# EAGLE design lightswitchx2_triac (EAGLE 7.6.0)
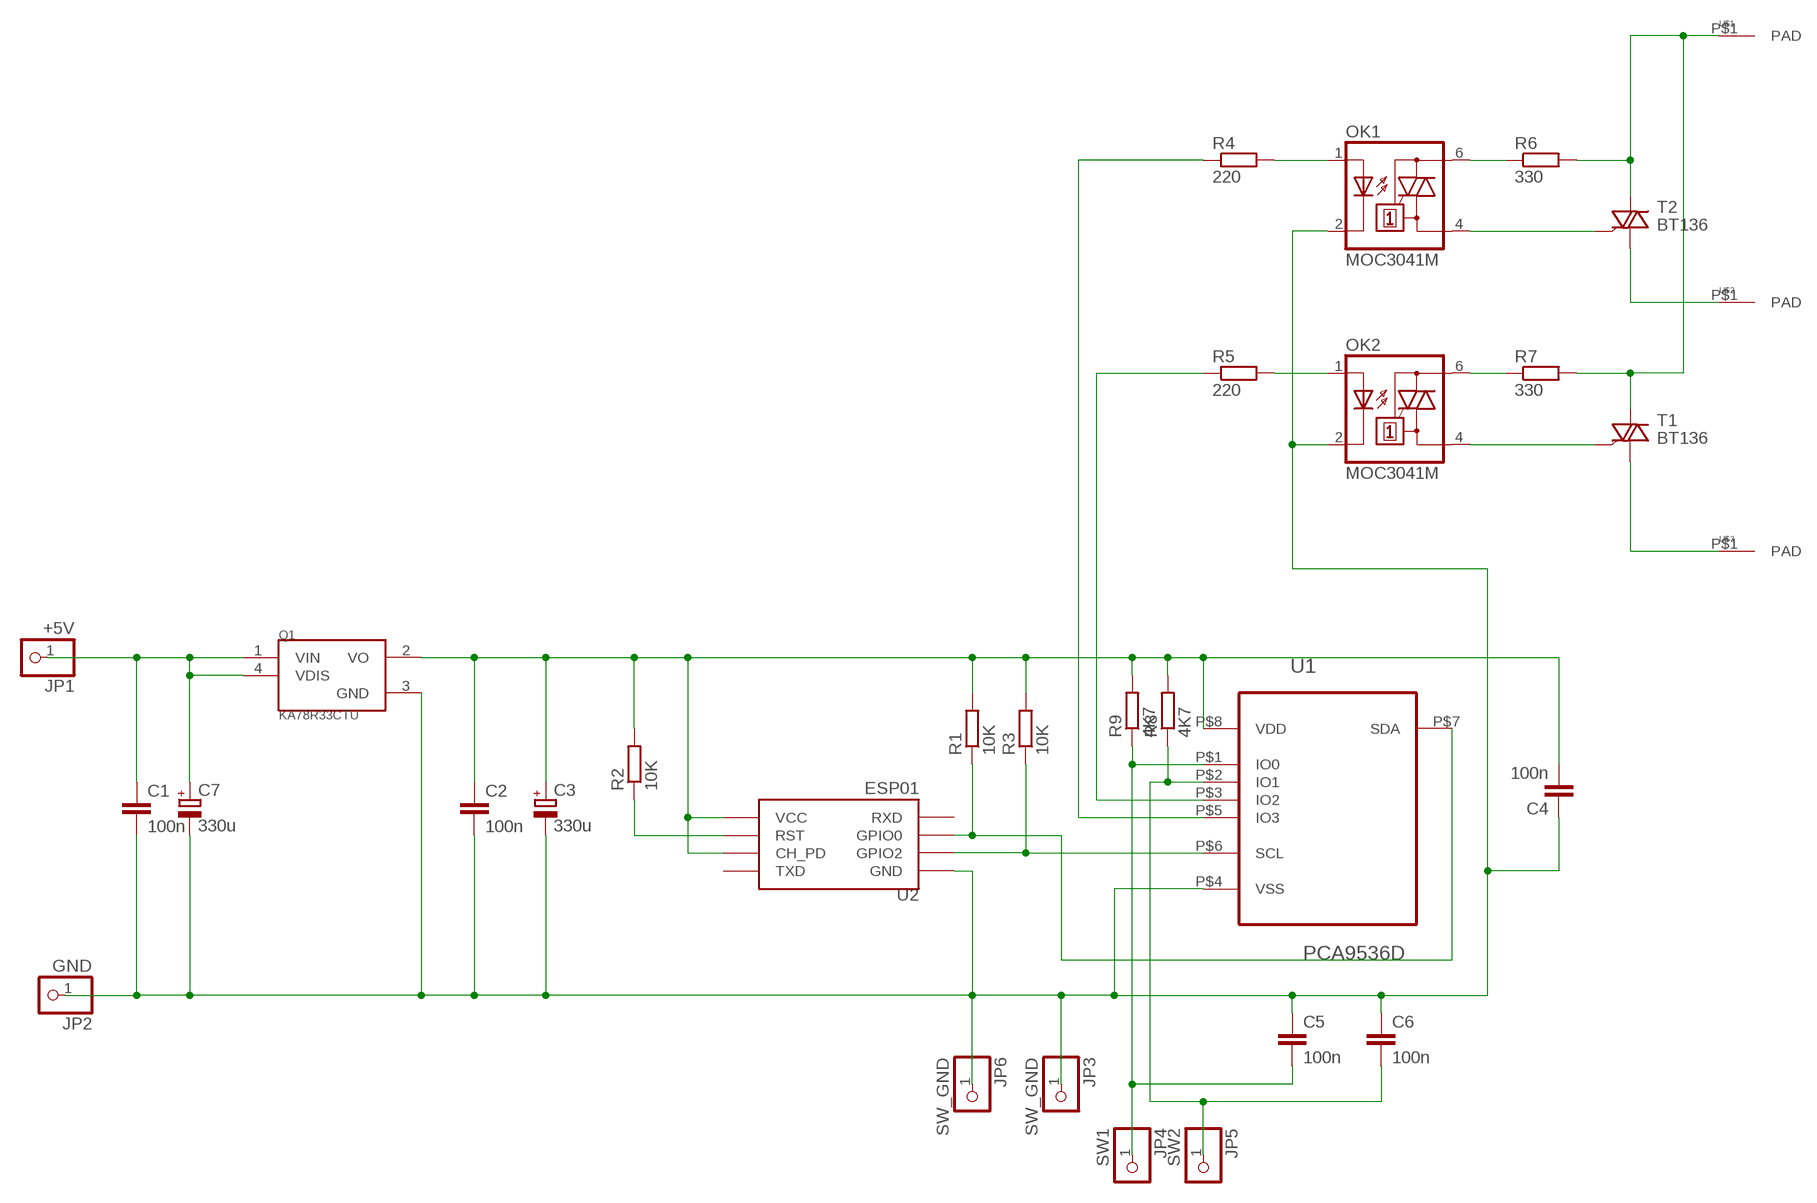
[diagram p0: schematic, sheet 1]

## Parts
C1  100n  C-EU050-024X044  [C050-024X044]
C2  100n  C-EU050-024X044  [C050-024X044]
C3  330u  CPOL-EUE2-5  [E2-5]
C4  100n  C-EU050-024X044  [C050-024X044]
C5  100n  C-EU050-024X044  [C050-024X044]
C6  100n  C-EU050-024X044  [C050-024X044]
C7  330u  CPOL-EUE2-5  [E2-5]
JP1  +5V  PINHD-1X1  [1X01]
JP2  GND  PINHD-1X1  [1X01]
JP3  SW_GND  PINHD-1X1CB  [1X01-CLEANBIG]
JP4  SW1  PINHD-1X1CB  [1X01-CLEANBIG]
JP5  SW2  PINHD-1X1CB  [1X01-CLEANBIG]
JP6  SW_GND  PINHD-1X1CB  [1X01-CLEANBIG]
OK1  MOC3041M  [DIL06]
OK2  MOC3041M  [DIL06]
Q1  KA78R33CTU  [TO-220-4]
R1  10K  R-EU_0207/10  [0207/10]
R2  10K  R-EU_0204/7  [0204/7]
R3  10K  R-EU_0204/7  [0204/7]
R4  220  R-EU_0207/7  [0207/7]
R5  220  R-EU_0207/7  [0207/7]
R6  330  R-EU_0207/7  [0207/7]
R7  330  R-EU_0207/7  [0207/7]
R8  4K7  R-EU_0207/7  [0207/7]
R9  4K7  R-EU_0207/10  [0207/10]
T1  BT136  [TO220AB]
T2  BT136  [TO220AB]
U1  PCA9536D  PCA9536D,118ADAPTER  [ADAPTER]
U2  ESP01  [ESP01]
U$1  PAD  [PAD]
U$2  PAD  [PAD]
U$3  PAD  [PAD]

## Nets
N$1: C1.1 C7.+ JP1.1 Q1.1(VIN) Q1.4(VDIS)
N$2: R4.1 U1.P$5(IO3)
N$3: OK1.1(A) R4.2
N$4: R1.1 U1.P$7(SDA) U2.GPIO0
N$5: OK2.1(A) R5.2
N$6: R3.1 U1.P$6(SCL) U2.GPIO2
N$7: R2.1 U2.RST
N$8: OK2.6(A2) R7.1
N$9: R5.1 U1.P$3(IO2)
N$10: OK1.6(A2) R6.1
N$11: C5.2 JP4.1 R9.1 U1.P$1(IO0)
N$12: R6.2 R7.2 T1.2(A2) T2.2(A2) U$1.P$1(PAD)
N$14: C6.2 JP5.1 R8.1 U1.P$2(IO1)
N$15: OK1.4(A1) T2.3(G)
N$16: OK2.4(A1) T1.3(G)
N$17: T2.1(A1) U$2.P$1(PAD)
N$18: T1.1(A1) U$3.P$1(PAD)
VDD: C2.1 C3.+ C4.2 Q1.2(VO) R1.2 R2.2 R3.2 R8.2 R9.2 U1.P$8(VDD) U2.CH_PD U2.VCC
VSS: C1.2 C2.2 C3.- C4.1 C5.1 C6.1 C7.- JP2.1 JP3.1 JP6.1 OK1.2(C) OK2.2(C) Q1.3(GND) U1.P$4(VSS) U2.GND
Unconnected: U2.RX(RXD) U2.TX(TXD)

## Library data of the parts
C1 C2 C4-C6 = rcl:C-EU: CAPACITOR, European symbol
C3 C7 = rcl:CPOL-EU: POLARIZED CAPACITOR, European symbol
JP1-JP6 = adafruit:PINHD-1X1: Pin header 1x1 for 0.1" spacing With round pins
OK1 OK2 = optocoupler:MOC30*: 6-Pin DIP Zero-Cross Optoisolators Triac Driver Output (250/400 Volt Peak) Source: Data sheet <http://www.fairchildsemi.com/ds/MO/MOC3031M.pdf> The old path of data sheet not more available 2013-05-06.; MF: FAIRCHILD SEMICONDUCTOR; MPN: MOC3041M; OC_FARNELL: 1086677; OC_NEWARK: 78K6090
Q1 = KA78R33CTU:KA78R33CTU: KA78R Series 3.3 V Fixed Output 1 A LDO Voltage Regulator - TO-220F-4L; AVAILABILITY: Good; DESCRIPTION: KA78R Series 3.3 V Fixed Output 1 A LDO Voltage Regulator - TO-220F-4L; MF: Fairchild Semiconductor; MP: KA78R33CTU; PACKAGE: TO-220 Fairchild Semiconductor; PRICE: 0.55 USD
R1-R9 = rcl:R-EU_: RESISTOR, European symbol
T1 T2 = triac:BT136: Triac BT136 series E sensitive gate Source: http://www.nxp.com/acrobat_download/datasheets/BT136_SERIES_E_2.pdf
U1 = PCA9536D:PCA9536D,118: 4-bit I2C-bus and SMBus I/O port
U2 = esp8266modules:ESP01: ESP8266 Wifi module 01
U$1-U$3 = LEG-1A-5:PAD

## Board
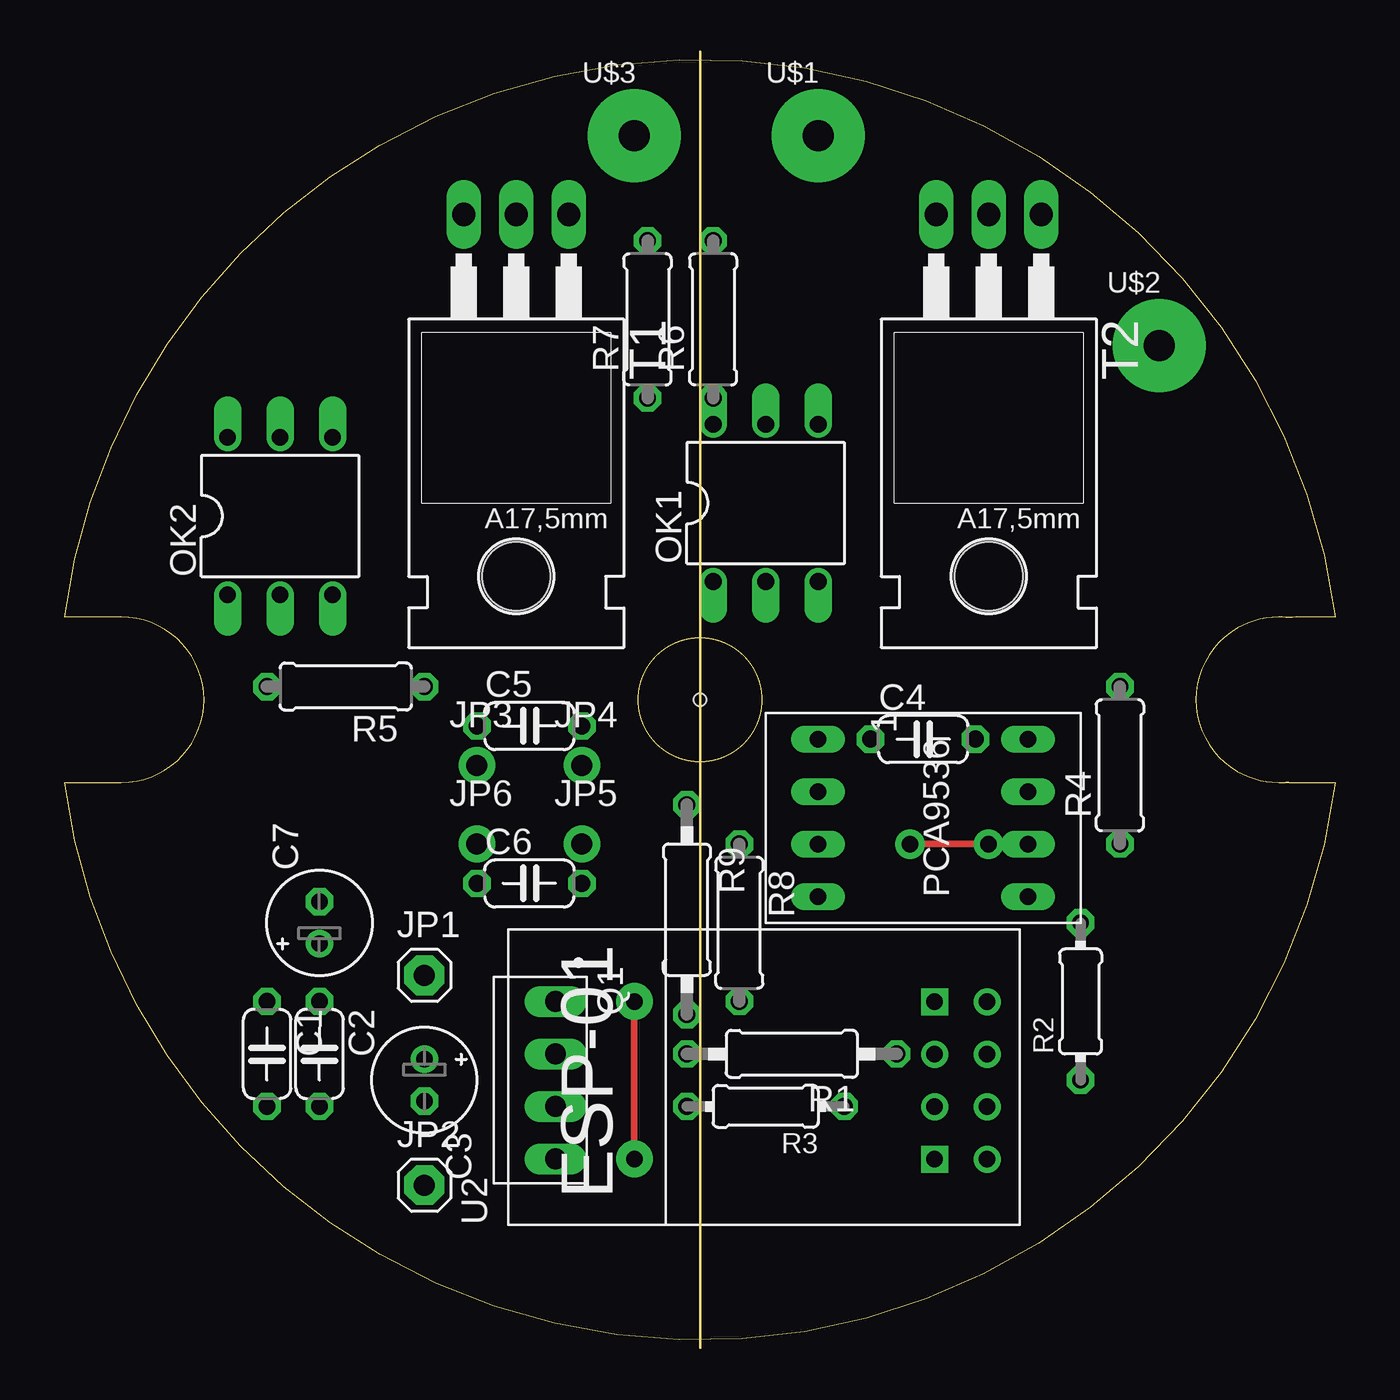
[diagram p1: board, top side]
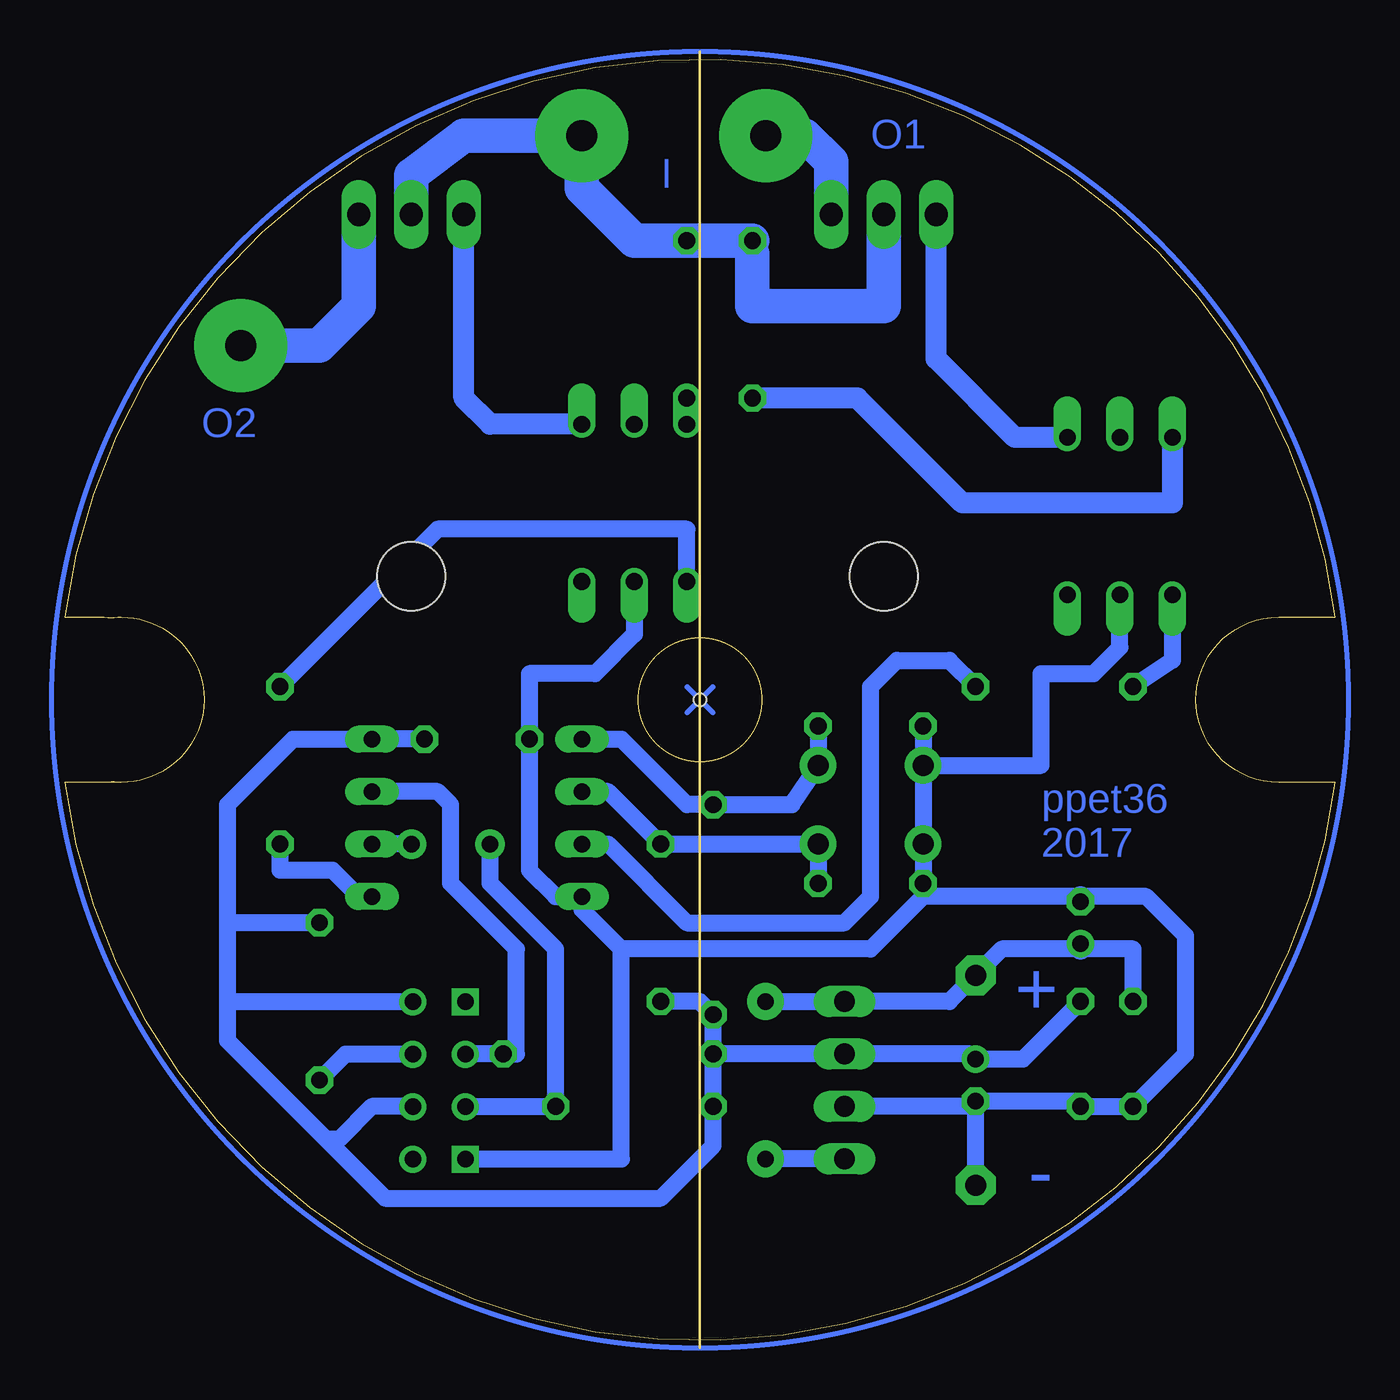
[diagram p2: board, bottom side, seen from below]

Size 61.48 x 61.97 mm. Coordinates in mm from the lower left corner, seen from the top.
Outline: 58.74,26.98 61.48,26.98 arc-113 15.24,4.14 arc-53 0,26.98 2.74,26.98 arc90 6.74,30.98 arc90 2.74,34.98 0,34.98 arc-53 15.24,57.83 arc-113 61.48,34.98 59.74,34.98 arc7 59.24,34.95 arc7 58.74,34.98 arc30 56.74,34.45 arc120 56.74,27.52 arc30 58.74,26.98
Outline: 58.74,26.98 arc7 59.24,27.02
Outline: circle at 30.74,30.98 radius 3
Copper layers (1*16): Top 0.035mm / dielectric 1.5mm / Bottom 0.035mm
Design rules "default": minimum track width 10mil, minimum drill 24mil, track to track 8mil, track to pad 8mil, pad to pad 8mil, via to via 8mil, smd to smd 8mil, copper to edge 40mil, drill to drill 8mil, minimum pad ring 10mil, minimum via ring 8mil, stop-mask expansion 4mil, vias tented up to drill 0mil, thermal gap 10mil
Holes 0.6 mm at 30.74,30.98

### Footprints (pad centres in the part's own frame; a part is rotated, then mirrored left to right if it is on the bottom)
C050-024X044 = drill 0.813 octagon: 1 -2.54,0; 2 2.54,0
E2-5 = drill 0.813 pad 1.27: + -1.016,0 | drill 0.813 pad 1.27 octagon: - 1.016,0
1X01 = drill 1.016 pad 1.93 octagon: 1 0,0
1X01-CLEANBIG = drill 1.016 pad 1.778: 1 0,0
DIL06 = drill 0.813 offset: 1 -2.54,-3.81; 2 0,-3.81; 3 2.54,-3.81; 4 2.54,3.81; 5 0,3.81; 6 -2.54,3.81
TO-220-4 = drill 1 long: 1 -3.81,0; 2 -1.27,0; 3 1.27,0; 4 3.81,0
0207/10 = drill 0.813 octagon: 1 -5.08,0; 2 5.08,0
0204/7 = drill 0.813 octagon: 1 -3.81,0; 2 3.81,0
0207/7 = drill 0.813 octagon: 1 -3.81,0; 2 3.81,0
TO220AB = drill 1.118 long: 1 -2.54,-6.35; 2 0,-6.35; 3 2.54,-6.35 | hole 3.302: 0,11.176
ADAPTER = drill 0.8 long: P$1 0,0; P$2 2.54,0; P$3 5.08,0; P$4 7.62,0; P$5 7.62,10.16; P$6 5.08,10.16; P$7 2.54,10.16; P$8 0,10.16
ESP01 = drill 0.8: CH_PD -1.285,-8.178; GPIO0 1.255,-5.638; GPIO2 -1.285,-5.638; RST 1.255,-8.178; TX -3.825,-8.178; VCC 3.795,-8.178 | drill 0.8 square: GND -3.825,-5.638; RX 3.795,-5.638
PAD = drill 1.5 pad 4.5: P$1 0,0

### Placement (x,y rotation side)
C1  9.79,13.84 270 top
C2  12.33,13.84 270 top
C3  17.41,12.57 270 top
C4  41.54,29.08 0 top
C5  22.49,29.71 0 top
C6  22.49,22.09 0 top
C7  12.33,20.19 90 top
JP1  17.41,17.65 0 top
JP2  17.41,7.49 0 top
JP3  19.95,27.81 0 top
JP4  25.03,27.81 0 top
JP5  25.03,24 0 top
JP6  19.95,24 0 top
OK1  33.92,40.51 0 top
OK2  10.42,39.87 0 top
Q1  23.76,12.57 270 top
R1  35.19,13.84 180 top
R2  49.16,16.38 90 top
R3  33.92,11.3 180 top
R4  51.06,27.81 90 top
R5  13.6,31.62 180 top
R6  31.38,49.4 90 top
R7  28.2,49.4 90 top
R8  32.65,20.19 270 top
R9  30.11,20.82 270 top
T1  21.85,48.13 180 top
T2  44.71,48.13 180 top
U1  36.46,29.08 270 top
U2  36.46,12.57 90 top
U$1  36.46,58.29 0 top
U$2  52.97,48.13 0 top
U$3  27.57,58.29 0 top

### Tracks (layer width: path | path; a pad name or v marks a point on that pad's centre or on a via)
N$1  (via drill 0.8 pad 1.78)
  Top 0.305: v27.57,8.76 v27.57,16.38
  Bottom 0.813: Q1.4 v27.57,8.76 | v27.57,16.38 Q1.1 18.68,16.38 JP1.1 16.14,18.92 12.33,18.92 9.79,18.92 C1.1
  Bottom 1.016: C7.+ 12.33,18.92
N$2
  Bottom 0.813: U1.P$5 47.25,21.46 48.52,22.73 51.06,22.73 R4.1
N$3
  Bottom 0.813: OK1.1 31.38,39.24 43.44,39.24 R4.2
N$4
  Bottom 0.813: U2.GPIO0 42.08,13.84 R1.1 39.63,13.84 39.63,18.92 42.81,22.09 42.81,25.9 43.44,26.54 U1.P$7
N$5
  Bottom 0.813: OK2.1 7.88,32.89 R5.2
N$6  (via drill 0.8 pad 1.42)
  Top 0.305: v40.9,24 v44.71,24
  Bottom 0.813: U2.GPIO2 42.08,11.3 R3.1 37.73,18.92 40.9,22.09 v40.9,24 | v44.71,24 U1.P$6
N$7
  Bottom 0.813: U2.RST 47.9,13.82 R2.1
N$8
  Bottom 1.016: R7.1 23.12,45.59 18.04,40.51 7.88,40.51 OK2.6
N$9
  Bottom 0.813: U1.P$3 35.19,24 31.38,20.19 23.76,20.19 22.49,21.46 22.49,31.62 21.22,32.89 18.68,32.89 R5.1
N$10
  Bottom 1.016: OK1.6 R6.1
N$11
  Bottom 0.813: U1.P$1 34.55,29.08 31.38,25.9 R9.1 26.3,25.9 JP4.1 C5.2
N$12
  Bottom 0.813: 28.2,52.57 28.84,53.21
  Bottom 1.676: T2.2 44.71,56.38 42.17,58.29 U$1.P$1 36.46,55.75 33.92,53.21 R6.2 28.84,53.21 R7.2 | T1.2 21.85,50.03 28.2,50.03 28.2,52.57
N$13
  Bottom 0.254: 30.11,30.35 31.38,31.62
N$14
  Bottom 0.813: U1.P$2 35.19,26.54 R8.1 JP5.1 C6.2
N$15
  Bottom 1.016: OK1.4 40.9,44.32 42.17,45.59 T2.3
N$16
  Bottom 1.016: OK2.4 15.5,43.68 19.31,47.49 T1.3
N$17
  Bottom 1.676: T2.1 47.25,50.03 49.16,48.13 U$2.P$1
N$18
  Bottom 1.676: T1.1 24.39,57.02 25.66,58.29 U$3.P$1
N$19
  Bottom 0.254: 30.11,31.62 31.38,30.35
VDD
  Bottom 0.813: C2.1 15.12,13.59 C3.+ 17.66,13.84 Q1.2 R1.2 | 48.84,9.71 45.98,6.85 32.65,6.85 30.11,9.39 R3.2 R1.2 | 48.84,9.71 53.6,14.47 53.6,16.38 | U2.CH_PD 44.65,11.3 46.62,11.3 48.2,9.71 48.84,9.71 | R8.2 30.74,16.38 R9.2 R1.2 | 53.6,16.38 53.6,20.19 | U2.VCC 53.59,16.36 53.6,16.38 | R2.2 53.6,20.19 | C4.2 U1.P$8 50.43,29.08 53.6,25.9 53.6,20.19
VSS
  Bottom 0.813: C3.- 12.58,11.55 C2.2 C1.2 7.25,13.84 7.25,19.55 9.15,21.46 12.33,21.46 19.95,21.46 | C3.- 17.66,11.3 Q1.3 | JP2.1 C3.- | JP3.1 JP6.1 C6.1 19.95,21.46 | 34.55,18.92 22.49,18.92 19.95,21.46 | 34.55,18.92 34.55,8.76 42.08,8.76 U2.GND | JP3.1 14.23,27.81 14.23,32.25 11.69,32.25 10.42,33.52 OK2.2 | OK1.2 33.92,34.16 35.82,32.25 39,32.25 C4.1 39,22.73 37.73,21.46 U1.P$4 36.46,20.82 34.55,18.92 | C5.1 JP3.1
  Bottom 1.016: C7.- 12.33,21.46
(copper drawn outside any net)
  shapes: Bottom circle x1

### Text on the board
Bottom: O1 | I | O2 | ppet36 / 2017 | + | -